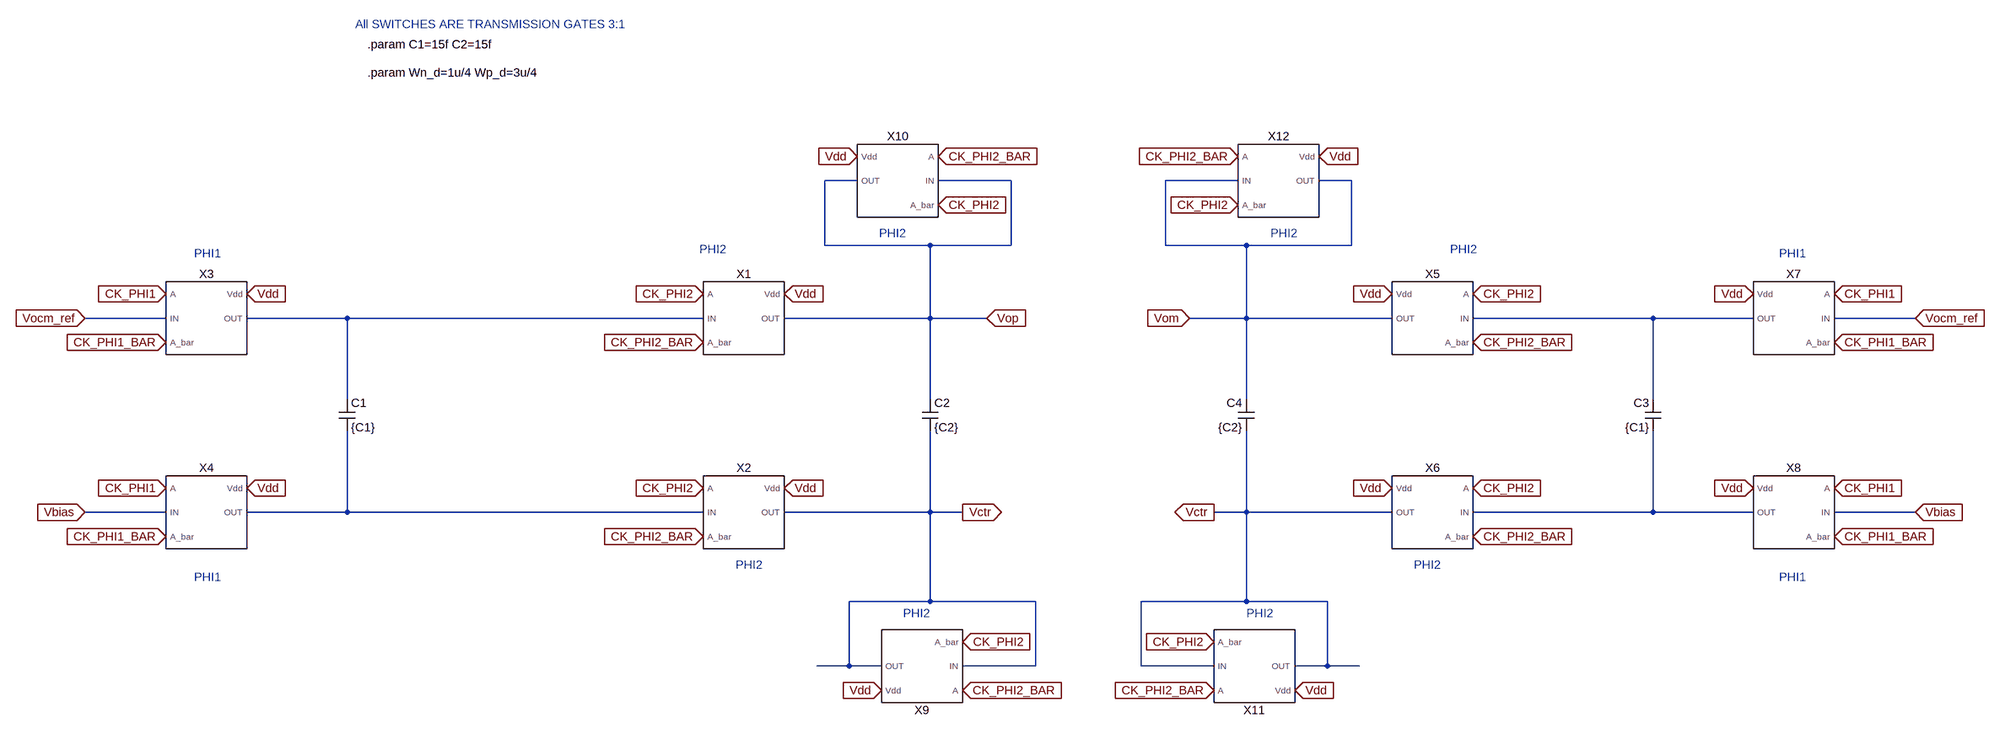
[diagram p0: schematic CS_CMFB.asc]
CS_CMFB.asc, the LTspice schematic file:
Version 4
SHEET 1 3192 1140
WIRE 512 -96 448 -96
WIRE 816 -96 672 -96
WIRE 1328 -96 1184 -96
WIRE 1552 -96 1488 -96
WIRE 448 32 448 -96
WIRE 656 32 448 32
WIRE 816 32 816 -96
WIRE 816 32 656 32
WIRE 1184 32 1184 -96
WIRE 1344 32 1184 32
WIRE 1552 32 1552 -96
WIRE 1552 32 1344 32
WIRE -864 176 -1024 176
WIRE -496 176 -704 176
WIRE 208 176 -496 176
WIRE 656 176 656 32
WIRE 656 176 368 176
WIRE 768 176 656 176
WIRE 1344 176 1344 32
WIRE 1344 176 1232 176
WIRE 1632 176 1344 176
WIRE 2496 176 1792 176
WIRE 2704 176 2496 176
WIRE 3024 176 2864 176
WIRE -496 336 -496 176
WIRE 656 336 656 176
WIRE 1344 336 1344 176
WIRE 2496 336 2496 176
WIRE -864 560 -1024 560
WIRE -496 560 -496 400
WIRE -496 560 -704 560
WIRE 208 560 -496 560
WIRE 656 560 656 400
WIRE 656 560 368 560
WIRE 720 560 656 560
WIRE 1344 560 1344 400
WIRE 1344 560 1280 560
WIRE 1632 560 1344 560
WIRE 2496 560 2496 400
WIRE 2496 560 1792 560
WIRE 2704 560 2496 560
WIRE 3024 560 2864 560
WIRE 656 736 656 560
WIRE 656 736 496 736
WIRE 864 736 656 736
WIRE 1344 736 1344 560
WIRE 1344 736 1136 736
WIRE 1504 736 1344 736
WIRE 496 864 496 736
WIRE 496 864 432 864
WIRE 560 864 496 864
WIRE 864 864 864 736
WIRE 864 864 720 864
WIRE 1136 864 1136 736
WIRE 1280 864 1136 864
WIRE 1504 864 1504 736
WIRE 1504 864 1440 864
WIRE 1568 864 1504 864
FLAG -1024 176 Vocm_ref
IOPIN -1024 176 In
FLAG 768 176 Vop
IOPIN 768 176 In
FLAG -704 128 Vdd
IOPIN -704 128 In
FLAG 368 128 Vdd
IOPIN 368 128 In
FLAG 368 512 Vdd
IOPIN 368 512 In
FLAG -704 512 Vdd
IOPIN -704 512 In
FLAG -864 128 CK_PHI1
IOPIN -864 128 In
FLAG -864 512 CK_PHI1
IOPIN -864 512 In
FLAG 208 128 CK_PHI2
IOPIN 208 128 In
FLAG 208 512 CK_PHI2
IOPIN 208 512 In
FLAG -864 224 CK_PHI1_BAR
IOPIN -864 224 In
FLAG -864 608 CK_PHI1_BAR
IOPIN -864 608 In
FLAG 208 224 CK_PHI2_BAR
IOPIN 208 224 In
FLAG 208 608 CK_PHI2_BAR
IOPIN 208 608 In
FLAG -1024 560 Vbias
IOPIN -1024 560 In
FLAG 720 560 Vctr
IOPIN 720 560 Out
FLAG 560 912 Vdd
IOPIN 560 912 In
FLAG 720 912 CK_PHI2_BAR
IOPIN 720 912 In
FLAG 720 816 CK_PHI2
IOPIN 720 816 In
FLAG 512 -144 Vdd
IOPIN 512 -144 In
FLAG 672 -144 CK_PHI2_BAR
IOPIN 672 -144 In
FLAG 672 -48 CK_PHI2
IOPIN 672 -48 In
FLAG 3024 176 Vocm_ref
IOPIN 3024 176 In
FLAG 1232 176 Vom
IOPIN 1232 176 In
FLAG 2704 128 Vdd
IOPIN 2704 128 In
FLAG 1632 128 Vdd
IOPIN 1632 128 In
FLAG 1632 512 Vdd
IOPIN 1632 512 In
FLAG 2704 512 Vdd
IOPIN 2704 512 In
FLAG 2864 128 CK_PHI1
IOPIN 2864 128 In
FLAG 2864 512 CK_PHI1
IOPIN 2864 512 In
FLAG 1792 128 CK_PHI2
IOPIN 1792 128 In
FLAG 1792 512 CK_PHI2
IOPIN 1792 512 In
FLAG 2864 224 CK_PHI1_BAR
IOPIN 2864 224 In
FLAG 2864 608 CK_PHI1_BAR
IOPIN 2864 608 In
FLAG 1792 224 CK_PHI2_BAR
IOPIN 1792 224 In
FLAG 1792 608 CK_PHI2_BAR
IOPIN 1792 608 In
FLAG 3024 560 Vbias
IOPIN 3024 560 In
FLAG 1280 560 Vctr
IOPIN 1280 560 Out
FLAG 1440 912 Vdd
IOPIN 1440 912 In
FLAG 1280 912 CK_PHI2_BAR
IOPIN 1280 912 In
FLAG 1280 816 CK_PHI2
IOPIN 1280 816 In
FLAG 1488 -144 Vdd
IOPIN 1488 -144 In
FLAG 1328 -144 CK_PHI2_BAR
IOPIN 1328 -144 In
FLAG 1328 -48 CK_PHI2
IOPIN 1328 -48 In
SYMBOL tgate 288 176 R0
SYMATTR InstName X1
SYMBOL tgate 288 560 R0
SYMATTR InstName X2
SYMBOL tgate -784 176 R0
SYMATTR InstName X3
SYMBOL tgate -784 560 R0
SYMATTR InstName X4
SYMBOL cap -512 336 R0
SYMATTR InstName C1
SYMATTR Value {C1}
SYMBOL cap 640 336 R0
SYMATTR InstName C2
SYMATTR Value {C2}
SYMBOL tgate 640 864 R180
SYMATTR SpiceLine L=0.28u Wn={Wn_d} Wp={Wp_d} M=1
SYMATTR InstName X9
SYMBOL tgate 592 -96 M0
SYMATTR SpiceLine L=0.28u Wn={Wn_d} Wp={Wp_d} M=1
SYMATTR InstName X10
SYMBOL tgate 1712 176 M0
SYMATTR InstName X5
SYMBOL tgate 1712 560 M0
SYMATTR InstName X6
SYMBOL tgate 2784 176 M0
SYMATTR InstName X7
SYMBOL tgate 2784 560 M0
SYMATTR InstName X8
SYMBOL cap 2512 336 M0
SYMATTR InstName C3
SYMATTR Value {C1}
SYMBOL cap 1360 336 M0
SYMATTR InstName C4
SYMATTR Value {C2}
SYMBOL tgate 1360 864 M180
SYMATTR SpiceLine L=0.28u Wn={Wn_d} Wp={Wp_d} M=1
SYMATTR InstName X11
SYMBOL tgate 1408 -96 R0
SYMATTR SpiceLine L=0.28u Wn={Wn_d} Wp={Wp_d} M=1
SYMATTR InstName X12
TEXT 200 40 Left 2 ;PHI2
TEXT 272 664 Left 2 ;PHI2
TEXT -808 48 Left 2 ;PHI1
TEXT -808 688 Left 2 ;PHI1
TEXT -456 -424 Left 2 !.param C1=15f C2=15f
TEXT -480 -464 Left 2 ;All SWITCHES ARE TRANSMISSION GATES 3:1
TEXT 656 760 Right 2 ;PHI2
TEXT -456 -368 Left 2 !.param Wn_d=1u/4 Wp_d=3u/4
TEXT 608 8 Right 2 ;PHI2
TEXT 1800 40 Right 2 ;PHI2
TEXT 1728 664 Right 2 ;PHI2
TEXT 2808 48 Right 2 ;PHI1
TEXT 2808 688 Right 2 ;PHI1
TEXT 1344 760 Left 2 ;PHI2
TEXT 1392 8 Left 2 ;PHI2

The netlist it stands for:
* CS_CMFB.asc
XX1 CK_PHI2 CK_PHI2_BAR N001 Vdd Vop tgate L=0.28u Wn=1u Wp=3u M=1  ; pins A A_bar IN Vdd OUT
XX2 CK_PHI2 CK_PHI2_BAR N003 Vdd Vctr tgate L=0.28u Wn=1u Wp=3u M=1  ; pins A A_bar IN Vdd OUT
XX3 CK_PHI1 CK_PHI1_BAR Vocm_ref Vdd N001 tgate L=0.28u Wn=1u Wp=3u M=1  ; pins A A_bar IN Vdd OUT
XX4 CK_PHI1 CK_PHI1_BAR Vbias Vdd N003 tgate L=0.28u Wn=1u Wp=3u M=1  ; pins A A_bar IN Vdd OUT
C1 N001 N003 {C1}
C2 Vop Vctr {C2}
XX9 CK_PHI2_BAR CK_PHI2 Vctr Vdd Vctr tgate L=0.28u Wn={Wn_d} Wp={Wp_d} M=1  ; pins A A_bar IN Vdd OUT
XX10 CK_PHI2_BAR CK_PHI2 Vop Vdd Vop tgate L=0.28u Wn={Wn_d} Wp={Wp_d} M=1  ; pins A A_bar IN Vdd OUT
XX5 CK_PHI2 CK_PHI2_BAR N002 Vdd Vom tgate L=0.28u Wn=1u Wp=3u M=1  ; pins A A_bar IN Vdd OUT
XX6 CK_PHI2 CK_PHI2_BAR N004 Vdd Vctr tgate L=0.28u Wn=1u Wp=3u M=1  ; pins A A_bar IN Vdd OUT
XX7 CK_PHI1 CK_PHI1_BAR Vocm_ref Vdd N002 tgate L=0.28u Wn=1u Wp=3u M=1  ; pins A A_bar IN Vdd OUT
XX8 CK_PHI1 CK_PHI1_BAR Vbias Vdd N004 tgate L=0.28u Wn=1u Wp=3u M=1  ; pins A A_bar IN Vdd OUT
C3 N002 N004 {C1}
C4 Vom Vctr {C2}
XX11 CK_PHI2_BAR CK_PHI2 Vctr Vdd Vctr tgate L=0.28u Wn={Wn_d} Wp={Wp_d} M=1  ; pins A A_bar IN Vdd OUT
XX12 CK_PHI2_BAR CK_PHI2 Vom Vdd Vom tgate L=0.28u Wn={Wn_d} Wp={Wp_d} M=1  ; pins A A_bar IN Vdd OUT
* PHI2
* PHI2
* PHI1
* PHI1
.param C1=15f C2=15f
* All SWITCHES ARE TRANSMISSION GATES 3:1
* PHI2
.param Wn_d=1u/4 Wp_d=3u/4
* PHI2
* PHI2
* PHI2
* PHI1
* PHI1
* PHI2
* PHI2
.backanno
.end